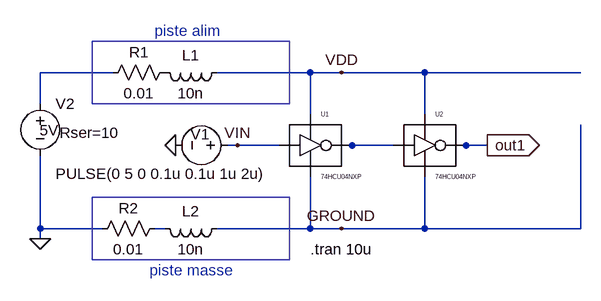
[diagram p0: schematic longeur_piste_inverseur.asc]
longeur_piste_inverseur.asc, the LTspice schematic file:
Version 4
SHEET 1 904 692
WIRE 112 48 0 48
WIRE 416 48 272 48
WIRE 464 48 416 48
WIRE 592 48 464 48
WIRE 832 48 592 48
WIRE 0 96 0 48
WIRE 416 112 416 48
WIRE 592 112 592 48
WIRE 304 160 288 160
WIRE 368 160 304 160
WIRE 480 160 464 160
WIRE 544 160 480 160
WIRE 656 160 640 160
WIRE 688 160 656 160
WIRE 0 288 0 176
WIRE 96 288 0 288
WIRE 192 288 176 288
WIRE 416 288 416 208
WIRE 416 288 272 288
WIRE 464 288 416 288
WIRE 592 288 592 208
WIRE 592 288 464 288
WIRE 832 288 832 128
WIRE 832 288 592 288
WIRE 0 304 0 288
FLAG 208 160 0
FLAG 304 160 VIN
FLAG 688 160 out1
IOPIN 688 160 Out
FLAG 0 304 0
FLAG 464 48 VDD
FLAG 464 288 GROUND
SYMBOL voltage 304 160 R90
WINDOW 123 0 0 Left 2
WINDOW 39 -19 182 VRight 2
WINDOW 0 -17 43 VRight 2
WINDOW 3 44 -44 VRight 2
SYMATTR SpiceLine Rser=10
SYMATTR InstName V1
SYMATTR Value PULSE(0 5 0 0.1u 0.1u 1u 2u)
SYMBOL voltage 0 80 R0
WINDOW 123 0 0 Left 2
WINDOW 39 0 0 Left 2
WINDOW 3 -1 57 Left 2
SYMATTR Value 5V
SYMATTR InstName V2
SYMBOL res 208 32 R90
WINDOW 0 0 56 VBottom 2
WINDOW 3 32 56 VTop 2
SYMATTR InstName R1
SYMATTR Value 0.01
SYMBOL ind 288 32 R90
WINDOW 0 5 56 VBottom 2
WINDOW 3 32 56 VTop 2
SYMATTR InstName L1
SYMATTR Value 10n
SYMBOL res 192 272 R90
WINDOW 0 0 56 VBottom 2
WINDOW 3 32 56 VTop 2
SYMATTR InstName R2
SYMATTR Value 0.01
SYMBOL ind 288 272 R90
WINDOW 0 5 56 VBottom 2
WINDOW 3 32 56 VTop 2
SYMATTR InstName L2
SYMATTR Value 10n
SYMBOL addon\\Digital\\74XX\\HC&U\\74hcu04nxp 416 96 R0
SYMATTR InstName U1
SYMBOL addon\\Digital\\74XX\\HC&U\\74hcu04nxp 592 96 R0
SYMATTR InstName U2
TEXT 416 320 Left 2 !.tran 10u
TEXT 176 -16 Left 2 ;piste alim
TEXT 168 352 Left 2 ;piste masse
RECTANGLE Normal 384 96 80 0
RECTANGLE Normal 384 336 80 240

The netlist it stands for:
* longeur_piste_inverseur.asc
V1 VIN 0 PULSE(0 5 0 0.1u 0.1u 1u 2u) Rser=10
V2 N001 0 5V
R1 P001 N001 0.01
L1 VDD P001 10n
R2 N003 0 0.01
L2 GROUND N003 10n
XU1 VIN N002 VDD GROUND inv0  ; pins A Y VCC VSS
XU2 N002 out1 VDD GROUND inv0  ; pins A Y VCC VSS
.tran 10u
* piste alim
* piste masse
.lib HC_TNOMI.CIR
.backanno
.end